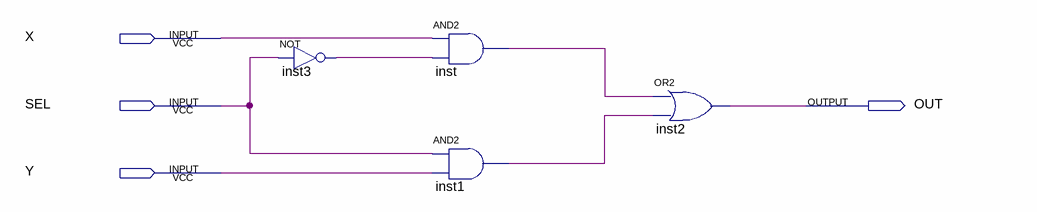
[diagram p0: schematic sheet]
// Quartus schematic Seletora.bdf as structural Verilog: 4 symbols, 4 pins
module Seletora (
  input  X,
  input  SEL,
  input  Y,
  output OUT
);

  wire inst1_out, inst3_out, inst_out;

  not inst3 (inst3_out, SEL);
  and inst (inst_out, X, inst3_out);
  and inst1 (inst1_out, SEL, Y);
  or inst2 (OUT, inst_out, inst1_out);
endmodule
